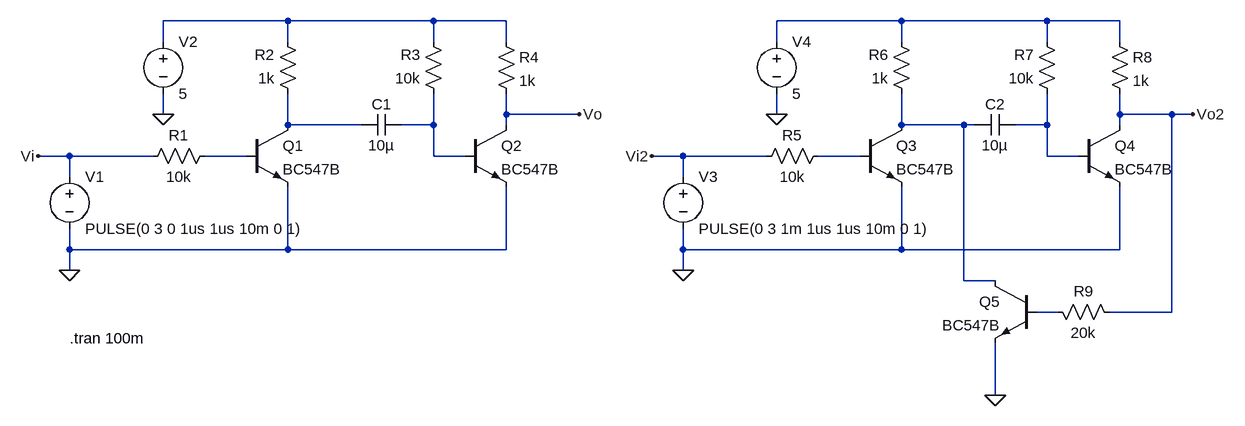
[diagram p0: schematic tr_pulse_gen.asc]
tr_pulse_gen.asc, the LTspice schematic file:
Version 4
SHEET 1 1772 680
WIRE 320 80 128 80
WIRE 544 80 320 80
WIRE 656 80 544 80
WIRE 1264 80 1072 80
WIRE 1488 80 1264 80
WIRE 1600 80 1488 80
WIRE 128 112 128 80
WIRE 320 112 320 80
WIRE 544 112 544 80
WIRE 656 112 656 80
WIRE 1072 112 1072 80
WIRE 1264 112 1264 80
WIRE 1488 112 1488 80
WIRE 1600 112 1600 80
WIRE 128 224 128 192
WIRE 656 224 656 192
WIRE 768 224 656 224
WIRE 1072 224 1072 192
WIRE 1600 224 1600 192
WIRE 1680 224 1600 224
WIRE 1712 224 1680 224
WIRE 320 240 320 192
WIRE 432 240 320 240
WIRE 544 240 544 192
WIRE 544 240 496 240
WIRE 656 240 656 224
WIRE 1264 240 1264 192
WIRE 1360 240 1264 240
WIRE 1376 240 1360 240
WIRE 1488 240 1488 192
WIRE 1488 240 1440 240
WIRE 1600 240 1600 224
WIRE -16 288 -64 288
WIRE 112 288 -16 288
WIRE 256 288 192 288
WIRE 544 288 544 240
WIRE 592 288 544 288
WIRE 928 288 880 288
WIRE 1056 288 928 288
WIRE 1200 288 1136 288
WIRE 1488 288 1488 240
WIRE 1536 288 1488 288
WIRE -16 320 -16 288
WIRE 928 320 928 288
WIRE -16 432 -16 400
WIRE 320 432 320 336
WIRE 320 432 -16 432
WIRE 656 432 656 336
WIRE 656 432 320 432
WIRE 928 432 928 400
WIRE 1264 432 1264 336
WIRE 1264 432 928 432
WIRE 1600 432 1600 336
WIRE 1600 432 1264 432
WIRE -16 464 -16 432
WIRE 928 464 928 432
WIRE 1360 480 1360 240
WIRE 1408 480 1360 480
WIRE 1504 528 1472 528
WIRE 1680 528 1680 224
WIRE 1680 528 1584 528
WIRE 1408 656 1408 576
FLAG -16 464 0
FLAG -64 288 Vi
FLAG 768 224 Vo
FLAG 128 224 0
FLAG 928 464 0
FLAG 880 288 Vi2
FLAG 1712 224 Vo2
FLAG 1072 224 0
FLAG 1408 656 0
SYMBOL Voltage -16 304 R0
SYMATTR InstName V1
SYMATTR Value PULSE(0 3 0 1us 1us 10m 0 1)
SYMBOL Res 208 272 R90
WINDOW 0 0 56 VBottom 2
WINDOW 3 32 56 VTop 2
SYMATTR InstName R1
SYMATTR Value 10k
SYMBOL Res 336 208 R180
WINDOW 0 36 76 Left 2
WINDOW 3 36 40 Left 2
SYMATTR InstName R2
SYMATTR Value 1k
SYMBOL Res 560 208 R180
WINDOW 0 36 76 Left 2
WINDOW 3 36 40 Left 2
SYMATTR InstName R3
SYMATTR Value 10k
SYMBOL npn 256 240 R0
SYMATTR InstName Q1
SYMATTR Value BC547B
SYMBOL npn 592 240 R0
SYMATTR InstName Q2
SYMATTR Value BC547B
SYMBOL Cap 496 224 R90
WINDOW 0 0 32 VBottom 2
WINDOW 3 32 32 VTop 2
SYMATTR InstName C1
SYMATTR Value 10µ
SYMBOL Res 640 96 R0
SYMATTR InstName R4
SYMATTR Value 1k
SYMBOL Voltage 128 96 R0
SYMATTR InstName V2
SYMATTR Value 5
SYMBOL Voltage 928 304 R0
SYMATTR InstName V3
SYMATTR Value PULSE(0 3 1m 1us 1us 10m 0 1)
SYMBOL Res 1152 272 R90
WINDOW 0 0 56 VBottom 2
WINDOW 3 32 56 VTop 2
SYMATTR InstName R5
SYMATTR Value 10k
SYMBOL Res 1280 208 R180
WINDOW 0 36 76 Left 2
WINDOW 3 36 40 Left 2
SYMATTR InstName R6
SYMATTR Value 1k
SYMBOL Res 1504 208 R180
WINDOW 0 36 76 Left 2
WINDOW 3 36 40 Left 2
SYMATTR InstName R7
SYMATTR Value 10k
SYMBOL npn 1200 240 R0
SYMATTR InstName Q3
SYMATTR Value BC547B
SYMBOL npn 1536 240 R0
SYMATTR InstName Q4
SYMATTR Value BC547B
SYMBOL Cap 1440 224 R90
WINDOW 0 0 32 VBottom 2
WINDOW 3 32 32 VTop 2
SYMATTR InstName C2
SYMATTR Value 10µ
SYMBOL Res 1584 96 R0
SYMATTR InstName R8
SYMATTR Value 1k
SYMBOL Voltage 1072 96 R0
SYMATTR InstName V4
SYMATTR Value 5
SYMBOL npn 1472 480 M0
SYMATTR InstName Q5
SYMATTR Value BC547B
SYMBOL Res 1600 544 M270
WINDOW 0 32 56 VTop 2
WINDOW 3 0 56 VBottom 2
SYMATTR InstName R9
SYMATTR Value 20k
TEXT -16 568 Left 2 !.tran 100m

The netlist it stands for:
* tr_pulse_gen.asc
V1 Vi 0 PULSE(0 3 0 1us 1us 10m 0 1)
R1 N007 Vi 10k
R2 N003 N001 1k
R3 N004 N001 10k
Q1 N003 N007 0 0 BC547B
Q2 Vo N004 0 0 BC547B
C1 N004 N003 10µ
R4 N001 Vo 1k
V2 N001 0 5
V3 Vi2 0 PULSE(0 3 1m 1us 1us 10m 0 1)
R5 N008 Vi2 10k
R6 N005 N002 1k
R7 N006 N002 10k
Q3 N005 N008 0 0 BC547B
Q4 Vo2 N006 0 0 BC547B
C2 N006 N005 10µ
R8 N002 Vo2 1k
V4 N002 0 5
Q5 N005 N009 0 0 BC547B
R9 Vo2 N009 20k
.model NPN NPN
.model PNP PNP
.lib standard.bjt
.tran 100m
.backanno
.end